# Altium project V_7.PrjPCB
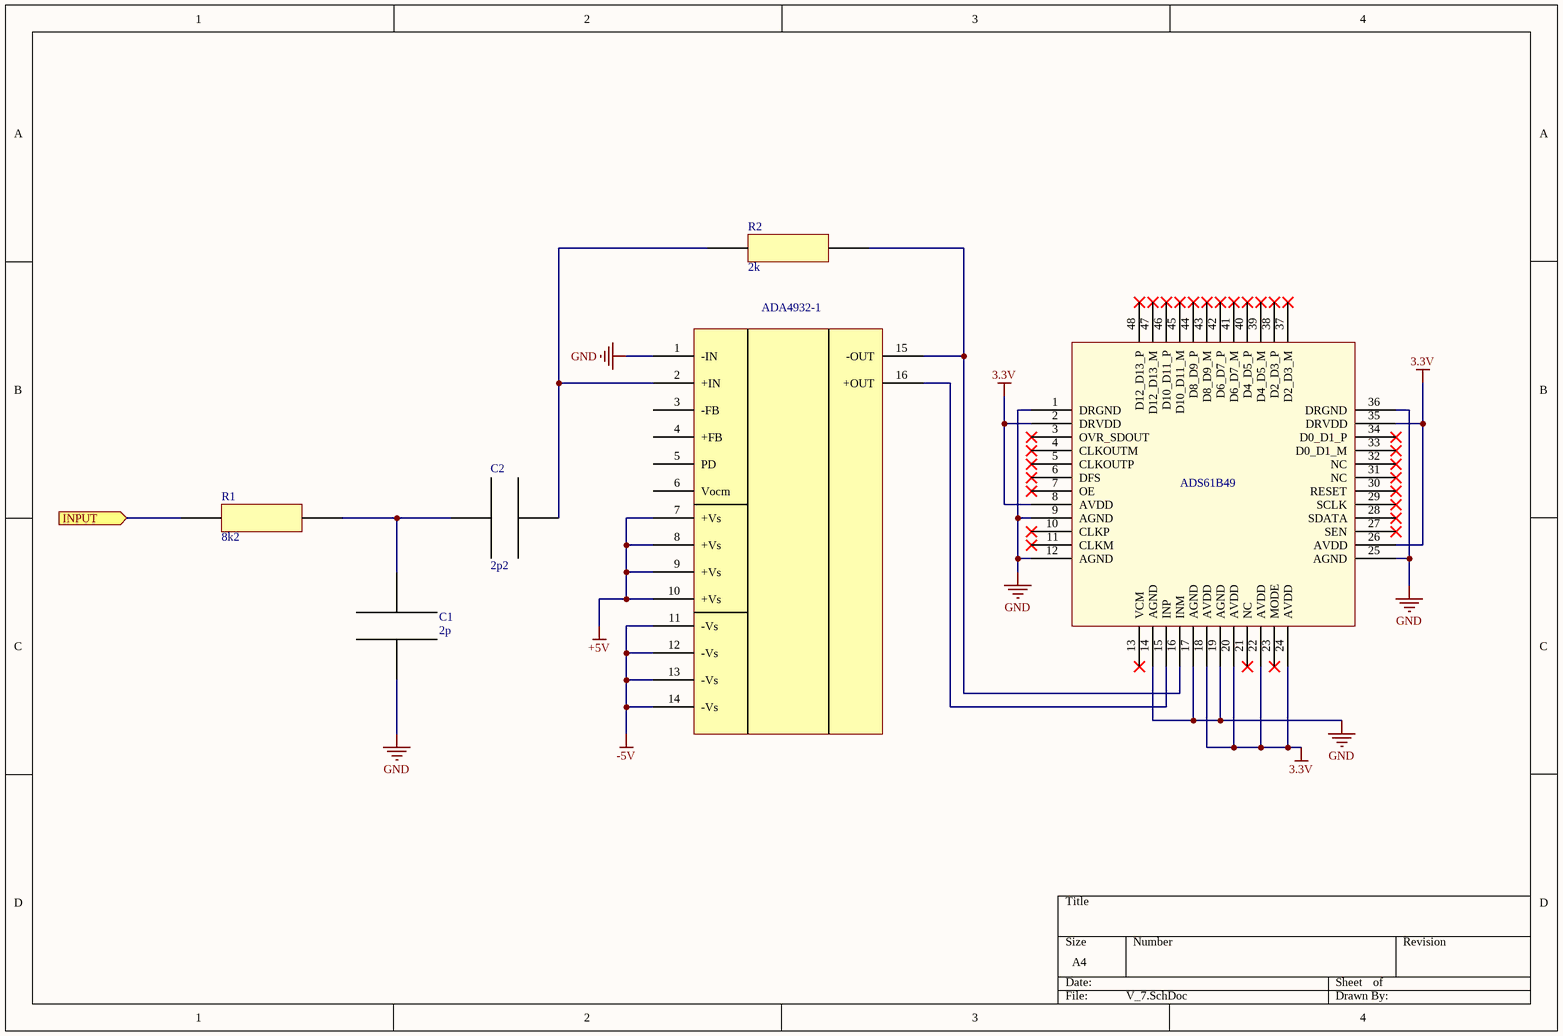
[diagram p0: V_7.SchDoc]
1 sheet, 6 parts. Net scope: flat (ports and power ports of the same name join across sheets).
Board file: V_7.PcbDoc

## Sheet V_7.SchDoc
size A4

### Parts
1  ADA4932-1  [ADA4932-1]
2  ADS61B49  [ADS61B49]
C1  2p  [SMD]
C2  2p2  [SMD]
R1  8k2  [SMD]
R2  2k  [SMD]

### Ports
INPUT (in)

### Nets
3.3V: 2.2(DRVDD) 2.8(AVDD) 2.18(AVDD) 2.20(AVDD) 2.22(AVDD) 2.24(AVDD) 2.26(AVDD) 2.35(DRVDD)
+5V: 1.7(+Vs) 1.8(+Vs) 1.9(+Vs) 1.10(+Vs)
-5V: 1.11(-Vs) 1.12(-Vs) 1.13(-Vs) 1.14(-Vs)
GND: 1.1(-IN) 2.1(DRGND) 2.9(AGND) 2.12(AGND) 2.14(AGND) 2.17(AGND) 2.19(AGND) 2.25(AGND) 2.36(DRGND) C1.1
Net1_2: 1.2(+IN) C2.2 R2.1
Net1_15: 1.15(-OUT) 2.16(INM) R2.2
Net1_16: 1.16(+OUT) 2.15(INP)
NetC1_2: C1.2 C2.1 R1.2
NetR1_1: R1.1 ; port INPUT

Not connected (* = marked no-connect by the designer): 1 3(-FB) 4(+FB) 5(PD) 6(Vocm); 2 3(OVR_SDOUT)* 4(CLKOUTM)* 5(CLKOUTP)* 6(DFS)* 7(OE)* 10(CLKP)* 11(CLKM)* 13(VCM)* 21(NC)* 23(MODE)* 27(SEN)* 28(SDATA)* 29(SCLK)* 30(RESET)* 31(NC)* 32(NC)* 33(D0_D1_M)* 34(D0_D1_P)* 37(D2_D3_M)* 38(D2_D3_P)* 39(D4_D5_M)* 40(D4_D5_P)* 41(D6_D7_M)* 42(D6_D7_P)* 43(D8_D9_M)* 44(D8_D9_P)* 45(D10_D11_M)* 46(D10_D11_P)* 47(D12_D13_M)* 48(D12_D13_P)*

### Library data of the parts
C1 C2 = CAP
R1 R2 = RES